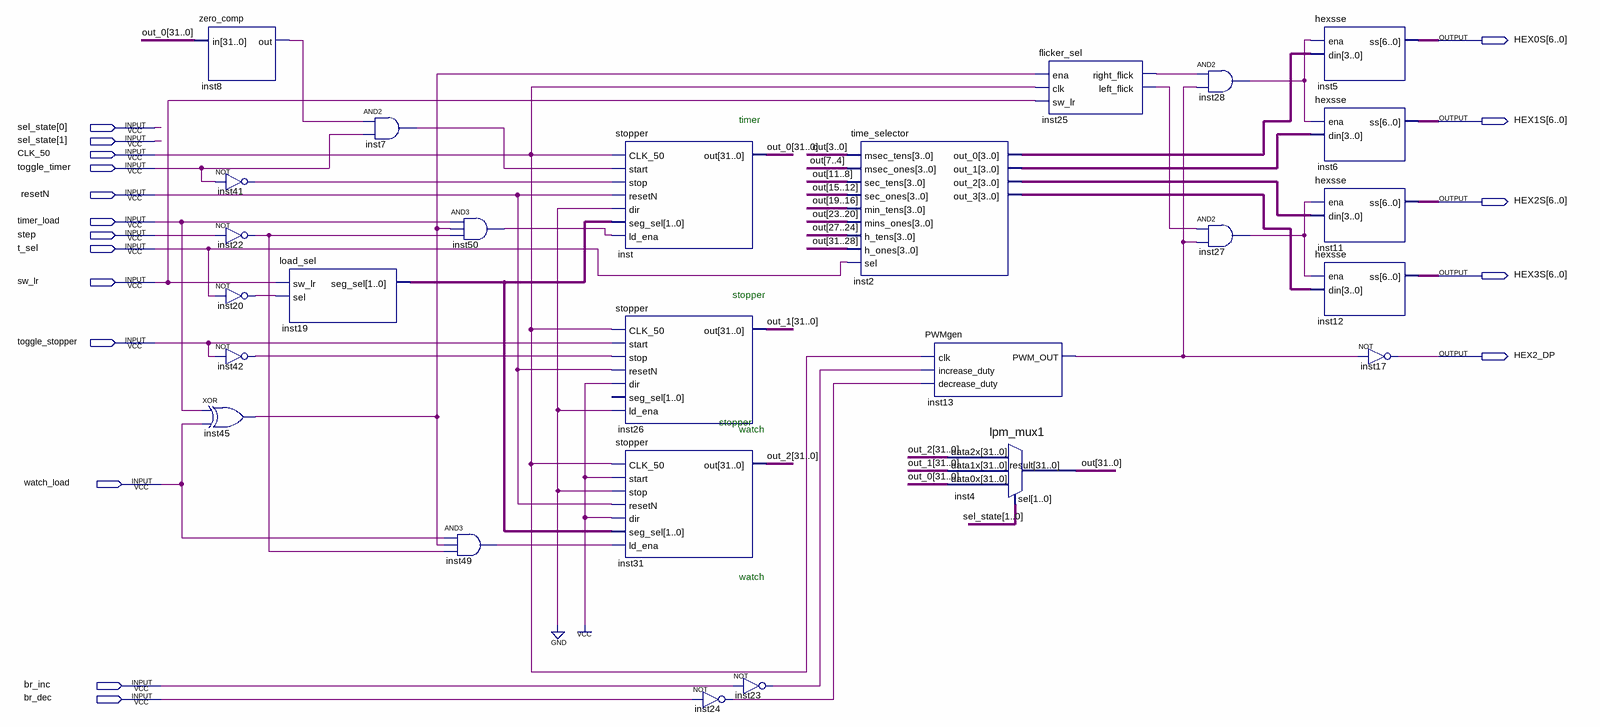
[diagram p0: schematic sheet]
// Quartus schematic periphery.bdf as structural Verilog: 26 symbols, 18 pins
module periphery (
  input  [1:0] sel_state,
  input  CLK_50,
  input  toggle_timer,
  input  resetN,
  input  timer_load,
  input  step,
  input  t_sel,
  input  sw_lr,
  input  toggle_stopper,
  input  watch_load,
  input  br_inc,
  input  br_dec,
  output [6:0] HEX0S,
  output [6:0] HEX1S,
  output [6:0] HEX2S,
  output [6:0] HEX3S,
  output HEX2_DP
);

  wire inst7_out, inst8_out, inst13_pwm_out, inst20_out, inst22_out, inst23_out, inst24_out,
       inst25_left_flick, inst25_right_flick, inst27_out, inst28_out, inst41_out, inst42_out, inst45_out,
       inst49_out, inst50_out;
  wire [1:0] inst19_seg_sel;
  wire [3:0] inst2_out_0, inst2_out_1, inst2_out_2, inst2_out_3;
  wire [31:0] out, out_0, out_1, out_2;

  zero_comp inst8 (.in(out_0), .out(inst8_out));
  not inst41 (inst41_out, toggle_timer);
  not inst22 (inst22_out, step);
  not inst20 (inst20_out, t_sel);
  not inst42 (inst42_out, toggle_stopper);
  xor inst45 (inst45_out, timer_load, watch_load);
  load_sel inst19 (.sw_lr(sw_lr), .sel(inst20_out), .seg_sel(inst19_seg_sel));
  and inst7 (inst7_out, inst8_out, toggle_timer);
  and inst50 (inst50_out, timer_load, inst45_out, inst22_out);
  and inst49 (inst49_out, watch_load, inst45_out, inst22_out);
  stopper inst (
    .CLK_50(CLK_50), .start(inst7_out), .stop(inst41_out), .resetN(resetN), .dir(1'b0),
    .seg_sel(inst19_seg_sel), .ld_ena(inst50_out), .out(out_0));
  stopper inst26 (
    .CLK_50(CLK_50), .start(toggle_stopper), .stop(inst42_out), .resetN(resetN), .dir(1'b1), .ld_ena(1'b0),
    .out(out_1));  // open: seg_sel
  stopper inst31 (
    .CLK_50(CLK_50), .start(1'b1), .stop(1'b0), .resetN(resetN), .dir(1'b1), .seg_sel(inst19_seg_sel),
    .ld_ena(inst49_out), .out(out_2));
  not inst24 (inst24_out, br_dec);
  not inst23 (inst23_out, br_inc);
  time_selector inst2 (
    .msec_tens(out[3:0]), .msec_ones(out[7:4]), .sec_tens(out[11:8]), .sec_ones(out[15:12]),
    .min_tens(out[19:16]), .mins_ones(out[23:20]), .h_tens(out[27:24]), .h_ones(out[31:28]), .sel(t_sel),
    .out_0(inst2_out_0), .out_1(inst2_out_1), .out_2(inst2_out_2), .out_3(inst2_out_3));
  PWMgen inst13 (.clk(CLK_50), .increase_duty(inst23_out), .decrease_duty(inst24_out), .PWM_OUT(inst13_pwm_out));
  lpm_mux1 inst4 (.data2x(out_2), .data1x(out_1), .data0x(out_0), .sel(sel_state), .result(out));
  flicker_sel inst25 (
    .ena(inst45_out), .clk(CLK_50), .sw_lr(sw_lr), .right_flick(inst25_right_flick),
    .left_flick(inst25_left_flick));
  and inst28 (inst28_out, inst25_right_flick, inst13_pwm_out);
  and inst27 (inst27_out, inst25_left_flick, inst13_pwm_out);
  hexsse inst5 (.ena(inst28_out), .din(inst2_out_0), .ss(HEX0S));
  hexsse inst6 (.ena(inst28_out), .din(inst2_out_1), .ss(HEX1S));
  hexsse inst11 (.ena(inst27_out), .din(inst2_out_2), .ss(HEX2S));
  hexsse inst12 (.ena(inst27_out), .din(inst2_out_3), .ss(HEX3S));
  not inst17 (HEX2_DP, inst13_pwm_out);

  // Notes on the sheet:
  //   timer
  //   stopper
  //   stopper
  //   watch
  //   watch
endmodule
